# Altium schematic sheet PMIC REGULATORS.SchDoc
size B
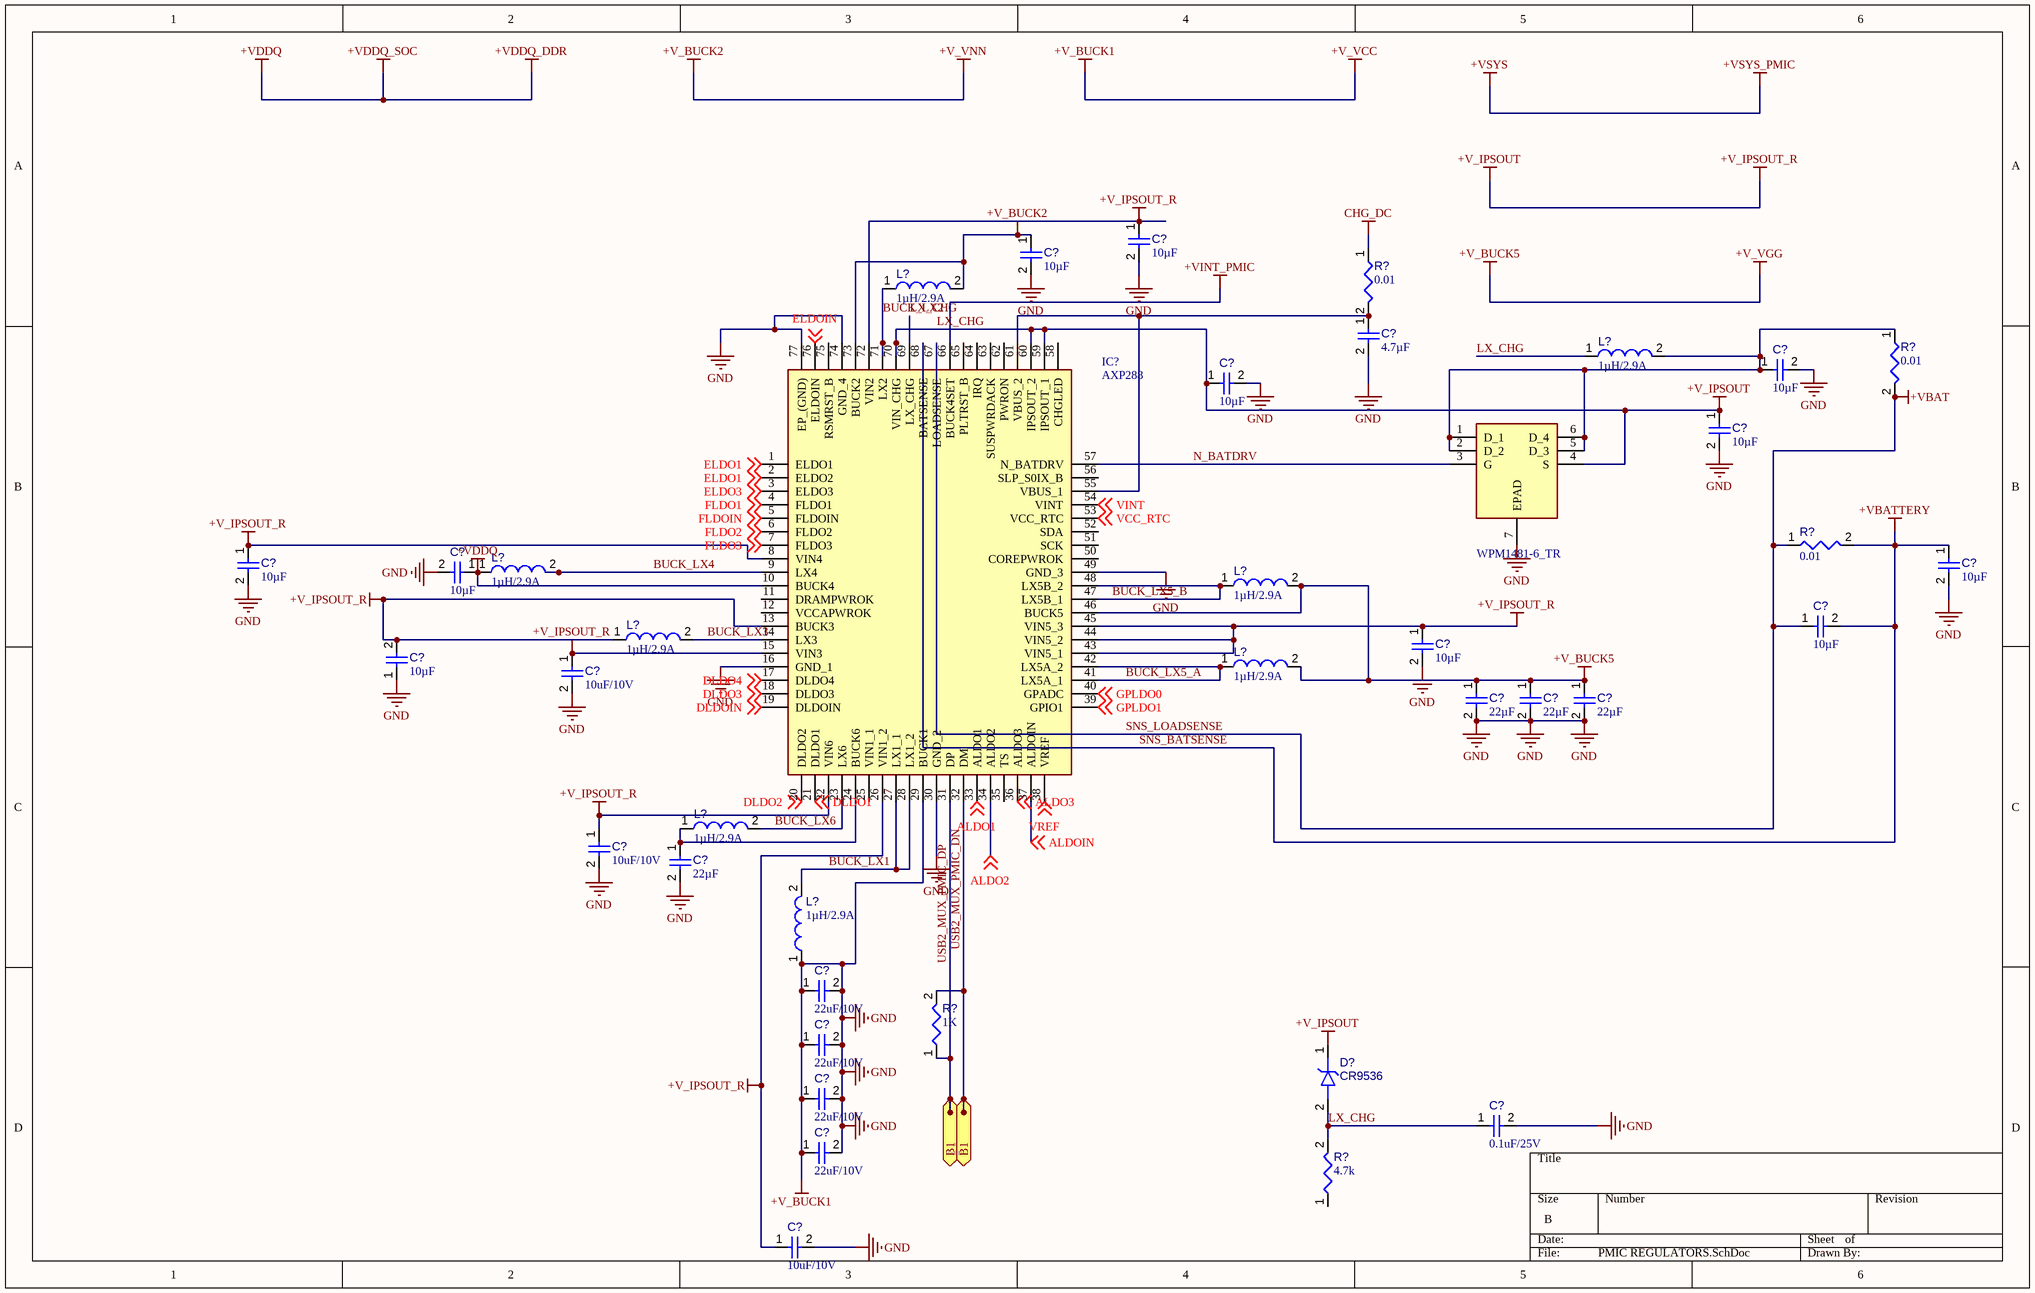
[diagram p0: PMIC REGULATORS.SchDoc]

## Parts
(Parts that share a designator on the sheet are numbered #1, #2 ... from top to bottom, then left to right.)
?  WPM1481-6_TR  [SON65P200X200X80-7N-D]
C?#1  value 10µF  [CAPC0402(1005)60_L]  (hidden comment: Capacitor 10µF +/-40% 6.3V 0402)
C?#2  value 10µF  [CAPC0402(1005)60_L]  (hidden comment: Capacitor 10µF +/-40% 6.3V 0402)
C?#3  value 4.7µF  [CAPC0805(2012)145_L]  (hidden comment: Capacitor 47µF +/-40% 6.3V 0805)
C?#4  value 10µF  [CAPC0402(1005)60_L]  (hidden comment: Capacitor 10µF +/-40% 6.3V 0402)
C?#5  value 10µF  [CAPC0805(2012)145_L]  (hidden comment: Capacitor 10µF +/-20% 25V 0805)
C?#6  value 10µF  [CAPC0402(1005)60_L]  (hidden comment: Capacitor 10µF +/-40% 6.3V 0402)
C?#7  value 10µF  [CAPC0402(1005)60_L]  (hidden comment: Capacitor 10µF +/-40% 6.3V 0402)
C?#8  value 10µF  [CAPC3216X180X50ML20T25]  (hidden comment: Capacitor 10 uF +/- 10% 16 V 1206)
C?#9  value 10µF  [CAPC0402(1005)60_L]  (hidden comment: Capacitor 10µF +/-40% 6.3V 0402)
C?#10  value 10µF  [CAPC0402(1005)60_L]  (hidden comment: Capacitor 10µF +/-40% 6.3V 0402)
C?#11  value 10µF  [CAPC3216X180X50ML20T25]  (hidden comment: Capacitor 10 uF +/- 10% 16 V 1206)
C?#12  value 10uF/10V  [CAPC0402(1005)60_L]  (hidden comment: Capacitor 100nF +/-20% 25V 0402)
C?#13  value 10µF  [CAPC0402(1005)60_L]  (hidden comment: Capacitor 10µF +/-40% 6.3V 0402)
C?#14  value 22µF  [CAPC0402(1005)60_L]  (hidden comment: Capacitor 10µF +/-40% 6.3V 0402)
C?#15  value 22µF  [CAPC0402(1005)60_L]  (hidden comment: Capacitor 10µF +/-40% 6.3V 0402)
C?#16  value 22µF  [CAPC0402(1005)60_L]  (hidden comment: Capacitor 10µF +/-40% 6.3V 0402)
C?#17  value 10uF/10V  [CAPC0402(1005)60_L]  (hidden comment: Capacitor 100nF +/-20% 25V 0402)
C?#18  value 22µF  [CAPC0402(1005)60_L]  (hidden comment: Capacitor 10µF +/-40% 6.3V 0402)
C?#19  value 22uF/10V  [CAPC0402(1005)60_L]  (hidden comment: Capacitor 10µF +/-40% 6.3V 0402)
C?#20  value 22uF/10V  [CAPC0402(1005)60_L]  (hidden comment: Capacitor 10µF +/-40% 6.3V 0402)
C?#21  value 22uF/10V  [CAPC0402(1005)60_L]  (hidden comment: Capacitor 10µF +/-40% 6.3V 0402)
C?#22  value 0.1uF/25V  [CAPC0402(1005)33_L]  (hidden comment: Capacitor 680pF +/-20% 50V 0402)
C?#23  value 22uF/10V  [CAPC0402(1005)60_L]  (hidden comment: Capacitor 10µF +/-40% 6.3V 0402)
C?#24  value 10uF/10V  [CAPC0402(1005)60_L]  (hidden comment: Capacitor 100nF +/-20% 25V 0402)
D?  CR9536  [STM-QFN1610]
IC?  AXP288  [QFN40P900X900X90-77N-D]
L?#1  WPN252012H1R0MT: 1µH/2.9A  [WE-LQS 4018]  (hidden comment: 74404042330)
L?#2  WPN252012H1R0MT: 1µH/2.9A  [WE-LQS 4018]  (hidden comment: 74404042330)
L?#3  WPN252012H1R0MT: 1µH/2.9A  [WE-LQS 4018]  (hidden comment: 74404042330)
L?#4  WPN252012H1R0MT: 1µH/2.9A  [WE-LQS 4018]  (hidden comment: 74404042330)
L?#5  WPN252012H1R0MT: 1µH/2.9A  [WE-LQS 4018]  (hidden comment: 74404042330)
L?#6  WPN252012H1R0MT: 1µH/2.9A  [WE-LQS 4018]  (hidden comment: 74404042330)
L?#7  WPN252012H1R0MT: 1µH/2.9A  [WE-LQS 4018]  (hidden comment: 74404042330)
L?#8  WPN252012H1R0MT: 1µH/2.9A  [WE-LQS 4018]  (hidden comment: 74404042330)
R?#1  value 0.01  [RESC0402(1005)_L]  (hidden comment: Resistor 47K5 +/-1 % 0402 63 mW)
R?#2  value 0.01  [RESC0402(1005)_L]  (hidden comment: Resistor 47K5 +/-1 % 0402 63 mW)
R?#3  value 0.01  [RESC0402(1005)_L]  (hidden comment: Resistor 47K5 +/-1 % 0402 63 mW)
R?#4  value 1K  [RESC0402(1005)_L]  (hidden comment: Resistor 47K5 +/-1 % 0402 63 mW)
R?#5  value 4.7k  [RESC1005X40X25ML05T05]  (hidden comment: Resistor 4k7 +/-1% 0402 63 mW)

## Ports
B1 (bidir)

## Nets
+V_BUCK1: ?.7(EPAD) C?#1.2 C?#2.2 C?#3.2 C?#4.2 C?#5.2 C?#6.2 C?#7.2 C?#8.2 C?#9.2 C?#10.2 C?#12.2 C?#13.1 C?#14.2 C?#15.2 C?#16.2 C?#17.2 C?#18.2 C?#19.1 C?#19.2 C?#20.1 C?#20.2 C?#21.1 C?#21.2 C?#22.2 C?#23.1 C?#23.2 C?#24.2 IC?.16(GND_1) IC?.29(BUCK1) IC?.30(GND_2) IC?.49(GND_3) IC?.74(GND_4) IC?.77(EP_(GND)) L?#8.1  [also labelled +V_VCC, GND]
+V_BUCK2: C?#2.1 IC?.73(BUCK2) L?#1.2  [also labelled +V_VNN]
+V_BUCK5: C?#14.1 C?#15.1 C?#16.1 IC?.46(BUCK5) L?#4.2 L?#6.2  [also labelled +V_VGG]
+VDDQ: C?#9.1 IC?.10(BUCK4) L?#3.1  [also labelled +VDDQ_DDR, +VDDQ_SOC]
+VINT_PMIC: IC?.66(BUCK4SET)
CHG_DC: R?#1.1
LX_CHG: ?.4(S) C?#1.1 C?#5.1 C?#6.1 C?#7.1 C?#10.1 C?#12.1 C?#13.2 C?#17.1 C?#22.1 C?#24.1 D?.1(A) D?.2(A) IC?.8(VIN4) IC?.13(BUCK3) IC?.15(VIN3) IC?.22(VIN6) IC?.26(VIN1_2) IC?.43(VIN5_1) IC?.44(VIN5_2) IC?.45(VIN5_3) IC?.59(IPSOUT_1) IC?.60(IPSOUT_2) IC?.69(LX_CHG) IC?.70(VIN_CHG) IC?.72(VIN2) L?#2.1 L?#5.1 R?#5.2  [also labelled +V_IPSOUT, +V_IPSOUT_R]
SNS_BATSENSE: C?#8.1 C?#11.2 IC?.68(BATSENSE) R?#3.2  [also labelled +VBATTERY]
SNS_LOADSENSE: C?#11.1 IC?.67(LOADSENSE) R?#2.2 R?#3.1  [also labelled +VBAT]
ALDO1: IC?.33(ALDO1) ; off-sheet ALDO1
ALDO2: IC?.34(ALDO2) ; off-sheet ALDO2
ALDO3: IC?.36(ALDO3) ; off-sheet ALDO3
ALDOIN: IC?.37(ALDOIN) ; off-sheet ALDOIN
BUCK_LX1: IC?.27(LX1_1) IC?.28(LX1_2) L?#8.2
BUCK_LX2: IC?.71(LX2) L?#1.1
BUCK_LX3: IC?.14(LX3) L?#5.2
BUCK_LX4: IC?.9(LX4) L?#3.2
BUCK_LX5_A: IC?.41(LX5A_1) IC?.42(LX5A_2) L?#6.1
BUCK_LX5_B: IC?.47(LX5B_1) IC?.48(LX5B_2) L?#4.1
BUCK_LX6: IC?.23(LX6) L?#7.2
DLDO1: IC?.21(DLDO1) ; off-sheet DLDO1
DLDO2: IC?.20(DLDO2) ; off-sheet DLDO2
DLDO3: IC?.18(DLDO3) ; off-sheet DLDO3
DLDO4: IC?.17(DLDO4) ; off-sheet DLDO4
DLDOIN: IC?.19(DLDOIN) ; off-sheet DLDOIN
ELDO1: IC?.1(ELDO1) IC?.2(ELDO2) ; off-sheet ELDO1
ELDO3: IC?.3(ELDO3) ; off-sheet ELDO3
ELDOIN: IC?.76(ELDOIN) ; off-sheet ELDOIN
FLDO1: IC?.4(FLDO1) ; off-sheet FLDO1
FLDO2: IC?.6(FLDO2) ; off-sheet FLDO2
FLDO3: IC?.7(FLDO3) ; off-sheet FLDO3
FLDOIN: IC?.5(FLDOIN) ; off-sheet FLDOIN
GPLDO0: IC?.40(GPADC) ; off-sheet GPLDO0
GPLDO1: IC?.39(GPIO1) ; off-sheet GPLDO1
N_BATDRV: ?.3(G) IC?.57(N_BATDRV)
USB2_MUX_PMIC_DN: IC?.31(DP) IC?.32(DM) R?#4.1 R?#4.2 ; port B1  [also labelled USB2_MUX_PMIC_DP]
VCC_RTC: IC?.53(VCC_RTC) ; off-sheet VCC_RTC
VINT: IC?.54(VINT) ; off-sheet VINT
VREF: IC?.38(VREF) ; off-sheet VREF
Net?_1: ?.1(D_1) ?.2(D_2) ?.5(D_3) ?.6(D_4) C?#4.1 L?#2.2 R?#2.1
NetC?#3_1: C?#3.1 IC?.55(VBUS_1) IC?.61(VBUS_2) R?#1.2
NetC?#18_1: C?#18.1 IC?.24(BUCK6) L?#7.1

Not connected (* = marked no-connect by the designer): IC? 11(DRAMPWROK) 12(VCCAPWROK) 25(VIN1_1) 35(TS) 50(COREPWROK) 51(SCK) 52(SDA) 56(SLP_S0IX_B) 58(CHGLED) 62(PWRON) 63(SUSPWRDACK) 64(IRQ) 65(PLTRST_B) 75(RSMRST_B); R?#5 1

## Library data of the parts
? = WPM1481-6_TR: Integrated Circuit; Manufacturer_Name: Will Semiconductor; Manufacturer_Part_Number: WPM1481-6/TR; Datasheet Link: http://hands.com/~lkcl/eoma/allwinner/a31/WPM1481.pdf; Height: 0.8mm
C?#1 C?#2 C?#4 C?#6 C?#7 C?#9 C?#10 C?#13-C?#16 C?#18-C?#21 C?#23 = CMP-001-00074-2: Chip Capacitor, 10µF +/-40%, 6.3V, 0402, Thickness 0.6 mm; Tolerance: 10%; Max Operating Temperature: 85°C; Pins: 2; Case/Package: 0402; Min Operating Temperature: -55°C; Voltage Rating: 6.3V; Mounting Technology: SMT
C?#3 = CMP-001-00082-2: Chip Capacitor, 47µF +/-40%, 6.3V, 0805, Thickness 1.45 mm; Tolerance: 10%; Max Operating Temperature: 85°C; Case/Package: 0402; Min Operating Temperature: -55°C; Voltage Rating: 6.3V; Pins: 2; Mounting Technology: SMT
C?#5 = CMP-001-00079-2: Chip Capacitor, 10µF +/-20%, 25V, 0805, Thickness 1.45 mm; Tolerance: 10%; Pins: 2; Max Operating Temperature: 85°C; Mounting Technology: SMT; Case/Package: 0603; Voltage Rating: 25V; Min Operating Temperature: -55°C
C?#8 C?#11 = CMP-001-00016-4: Chip Capacitor, 10 uF, +/- 10%, 16 V, 1206 (3216 Metric); Voltage Rating: 16V; Capacitor Type: Ceramic; Tolerance: 10%; Pins: 2; Case/Package: 1206; Mounting Technology: SM; RoHS Compliant: True; Max Operating Temperature: 125°C; Min Operating Temperature: -55°C
C?#12 C?#17 C?#24 = CMP-001-00065-2: Chip Capacitor, 100nF +/-20%, 25V, 0402, Thickness 0.6 mm; Tolerance: 10%; Pins: 2; Min Operating Temperature: -55°C; Max Operating Temperature: 85°C; Mounting Technology: SMT; Case/Package: 0603; Voltage Rating: 25V
C?#22 = CMP-001-00070-2: Chip Capacitor, 680pF +/-20%, 50V, 0402, Thickness 0.33 mm; Tolerance: 10%; Pins: 2; Min Operating Temperature: -55°C; Max Operating Temperature: 85°C; Mounting Technology: SMT; Case/Package: 0402; Voltage Rating: 50V
D? = CMP-004-00023-2: CR9536 / 5V6; Max Surge Current: 35A; Peak Inverse Voltage: 23.3V; RoHS Compliant: Yes; Mounting Technology: SMT; Pins: 2; Case/Package: QFN1610 (0603)
IC? = AXP288: Integrated Circuit; Manufacturer_Name: X-Powers; Datasheet Link: http://www.x-powers.com/en.php/Info/support/article_id/60; Height: 0.9mm; Manufacturer_Part_Number: AXP288
L?#1-L?#8 = CMP-006-00018-2: WE-LQS SMD Power Inductor, L=33 µH; Tolerance: 20%; ComponentLink2URL: http://katalog.we-online.de/pbs/datasheet/74404042330.pdf; ComponentLink2Description: Datasheet; ComponentLink1Description: Manufacturer URL; Pins: 2; ComponentLink1URL: http://www.we-online.com
R?#1-R?#3 = CMP-009-00137-2: Chip Resistor, 47,5 kOhms, +/-1 %, 63 mW, -55 to 155 degC, 0402; Tolerance: 1%; Power: 63mW; Pins: 2; Case/Package: 0402; Max Operating Temperature: 155°C; Min Operating Temperature: -55°C
R?#4 = CMP-009-00137-2: Chip Resistor,0ROhms, +/-1 %, 63 mW, -55 to 155 degC, 0402; Tolerance: 1%; Power: 63mW; Pins: 2; Case/Package: 0402; Max Operating Temperature: 155°C; Min Operating Temperature: -55°C
R?#5 = CMP-009-00034-4: Chip Resistor, 4.7 KOhm, +/- 1%, 63 mW, -55 to 155 degC, 0402 (1005 Metric); Voltage Rating: 50V; Power: 63mW; Tolerance: 1%; Pins: 2; Case/Package: 0402; Mounting Technology: SM; Min Operating Temperature: -55°C; Max Operating Temperature: 155°C; RoHS Compliant: True